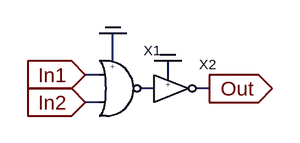
[diagram p0: schematic nm_or.asc]
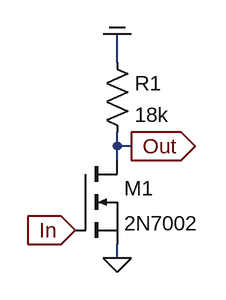
[diagram p1: sub-circuit nm_not.asc]
nm_or.asc, the LTspice schematic file:
Version 4
SHEET 1 880 680
WIRE 352 96 352 64
WIRE 336 112 320 112
WIRE 416 112 416 96
WIRE 400 128 384 128
WIRE 464 128 448 128
WIRE 336 144 320 144
FLAG 320 112 In1
IOPIN 320 112 In
FLAG 464 128 Out
IOPIN 464 128 Out
FLAG 320 144 In2
IOPIN 320 144 In
FLAG 416 96 COM
FLAG 352 64 COM
SYMBOL nm_not 416 128 R0
SYMATTR InstName X2
SYMBOL nm_nor 352 128 R0
SYMATTR InstName X1

nm_not.asc, the sub-circuit schematic file:
Version 4
SHEET 1 880 680
WIRE 224 32 224 0
WIRE 224 128 224 112
WIRE 240 128 224 128
WIRE 224 144 224 128
WIRE 224 256 224 240
FLAG 224 256 0
FLAG 176 224 In
IOPIN 176 224 In
FLAG 240 128 Out
IOPIN 240 128 Out
FLAG 224 0 COM
SYMBOL nmos 176 144 R0
SYMATTR InstName M1
SYMATTR Value 2N7002
SYMBOL res 208 16 R0
SYMATTR InstName R1
SYMATTR Value 18k

The netlist it stands for:
* nm_or.asc
XX2 N001 Out COM nm_not
XX1 In2 N001 COM In1 nm_nor  ; pins In2 Out COM In1

* block symbol definitions
.subckt nm_not In Out COM
M1 Out In 0 0 2N7002
R1 COM Out 18k
.ends nm_not

.model NMOS NMOS
.model PMOS PMOS
.lib standard.mos
.backanno
.end